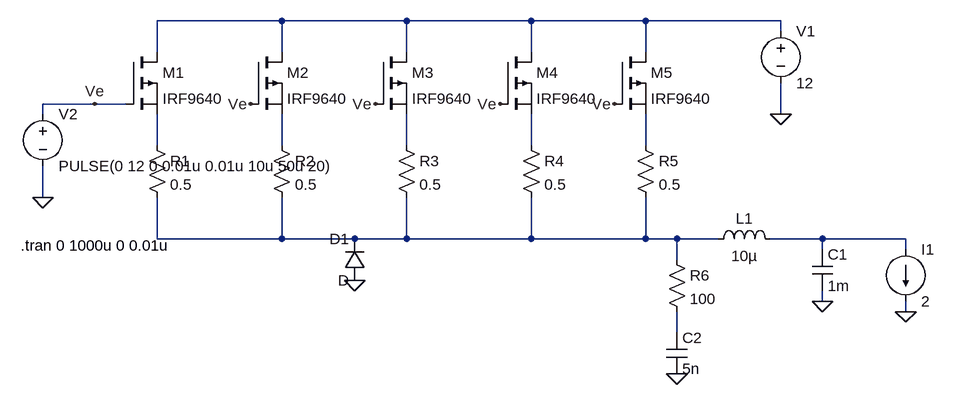
[diagram p0: schematic ej_conmu.asc]
ej_conmu.asc, the LTspice schematic file:
Version 4
SHEET 1 1312 680
WIRE 304 64 112 64
WIRE 496 64 304 64
WIRE 688 64 496 64
WIRE 864 64 688 64
WIRE 1072 64 864 64
WIRE 1072 80 1072 64
WIRE 112 112 112 64
WIRE 304 112 304 64
WIRE 496 112 496 64
WIRE 688 112 688 64
WIRE 864 112 864 64
WIRE 16 192 -64 192
WIRE 64 192 16 192
WIRE -64 208 -64 192
WIRE 1072 208 1072 160
WIRE 112 256 112 208
WIRE 304 256 304 208
WIRE 496 256 496 208
WIRE 688 256 688 208
WIRE 864 256 864 208
WIRE -64 336 -64 288
WIRE 112 400 112 336
WIRE 304 400 304 336
WIRE 304 400 112 400
WIRE 416 400 304 400
WIRE 496 400 496 336
WIRE 496 400 416 400
WIRE 688 400 688 336
WIRE 688 400 496 400
WIRE 864 400 864 336
WIRE 864 400 688 400
WIRE 912 400 864 400
WIRE 976 400 912 400
WIRE 1136 400 1056 400
WIRE 1264 400 1136 400
WIRE 1136 416 1136 400
WIRE 1264 416 1264 400
WIRE 912 432 912 400
WIRE 1136 496 1136 480
WIRE 1264 512 1264 496
WIRE 912 544 912 512
FLAG 1072 208 0
FLAG -64 336 0
FLAG 1264 512 0
FLAG 1136 496 0
FLAG 256 192 Ve
FLAG 448 192 Ve
FLAG 640 192 Ve
FLAG 816 192 Ve
FLAG 16 192 Ve
FLAG 416 464 0
FLAG 912 608 0
SYMBOL pmos 64 112 R0
SYMATTR InstName M1
SYMATTR Value IRF9640
SYMBOL pmos 256 112 R0
SYMATTR InstName M2
SYMATTR Value IRF9640
SYMBOL pmos 448 112 R0
SYMATTR InstName M3
SYMATTR Value IRF9640
SYMBOL pmos 640 112 R0
SYMATTR InstName M4
SYMATTR Value IRF9640
SYMBOL pmos 816 112 R0
SYMATTR InstName M5
SYMATTR Value IRF9640
SYMBOL res 96 240 R0
SYMATTR InstName R1
SYMATTR Value 0.5
SYMBOL res 288 240 R0
SYMATTR InstName R2
SYMATTR Value 0.5
SYMBOL res 480 240 R0
SYMATTR InstName R3
SYMATTR Value 0.5
SYMBOL res 672 240 R0
SYMATTR InstName R4
SYMATTR Value 0.5
SYMBOL res 848 240 R0
SYMATTR InstName R5
SYMATTR Value 0.5
SYMBOL voltage 1072 64 R0
WINDOW 123 0 0 Left 0
WINDOW 39 0 0 Left 0
SYMATTR InstName V1
SYMATTR Value 12
SYMBOL voltage -64 192 R0
WINDOW 123 0 0 Left 0
WINDOW 39 0 0 Left 0
SYMATTR InstName V2
SYMATTR Value PULSE(0 12 0 0.01u 0.01u 10u 50u 20)
SYMBOL ind 960 416 R270
WINDOW 0 32 56 VTop 2
WINDOW 3 5 56 VBottom 2
SYMATTR InstName L1
SYMATTR Value 10µ
SYMBOL cap 1120 416 R0
SYMATTR InstName C1
SYMATTR Value 1m
SYMBOL current 1264 416 R0
WINDOW 123 0 0 Left 0
WINDOW 39 0 0 Left 0
SYMATTR InstName I1
SYMATTR Value 2
SYMBOL res 896 416 R0
SYMATTR InstName R6
SYMATTR Value 100
SYMBOL cap 896 544 R0
SYMATTR InstName C2
SYMATTR Value 5n
SYMBOL diode 432 464 R180
WINDOW 0 24 64 Left 2
WINDOW 3 24 0 Left 2
SYMATTR InstName D1
TEXT -98 410 Left 2 !.tran 0 1000u 0 0.01u

The netlist it stands for:
* ej_conmu.asc
M1 N001 Ve N002 N002 IRF9640
M2 N001 Ve N003 N003 IRF9640
M3 N001 Ve N004 N004 IRF9640
M4 N001 Ve N005 N005 IRF9640
M5 N001 Ve N006 N006 IRF9640
R1 N002 N007 0.5
R2 N003 N007 0.5
R3 N004 N007 0.5
R4 N005 N007 0.5
R5 N006 N007 0.5
V1 N001 0 12
V2 Ve 0 PULSE(0 12 0 0.01u 0.01u 10u 50u 20)
L1 N007 N008 10µ
C1 N008 0 1m
I1 N008 0 2
R6 N007 N009 100
C2 N009 0 5n
D1 0 N007 D
.model D D
.lib standard.dio
.model NMOS NMOS
.model PMOS PMOS
.lib standard.mos
.tran 0 1000u 0 0.01u
.backanno
.end